# Altium schematic sheet PIC18F57Q84_Curiosity_Nano_Target_MCU.SchDoc
size A3; SheetTitle: Target MCU; CompanyName: Microchip Technology Inc.; Organization: Microchip Technology; Address1: 2355 West Chandler Blvd.; Address2: Chandler, AZ  85224; Address4: USA; SheetNumber: 2; SheetTotal: 4; Time: Time
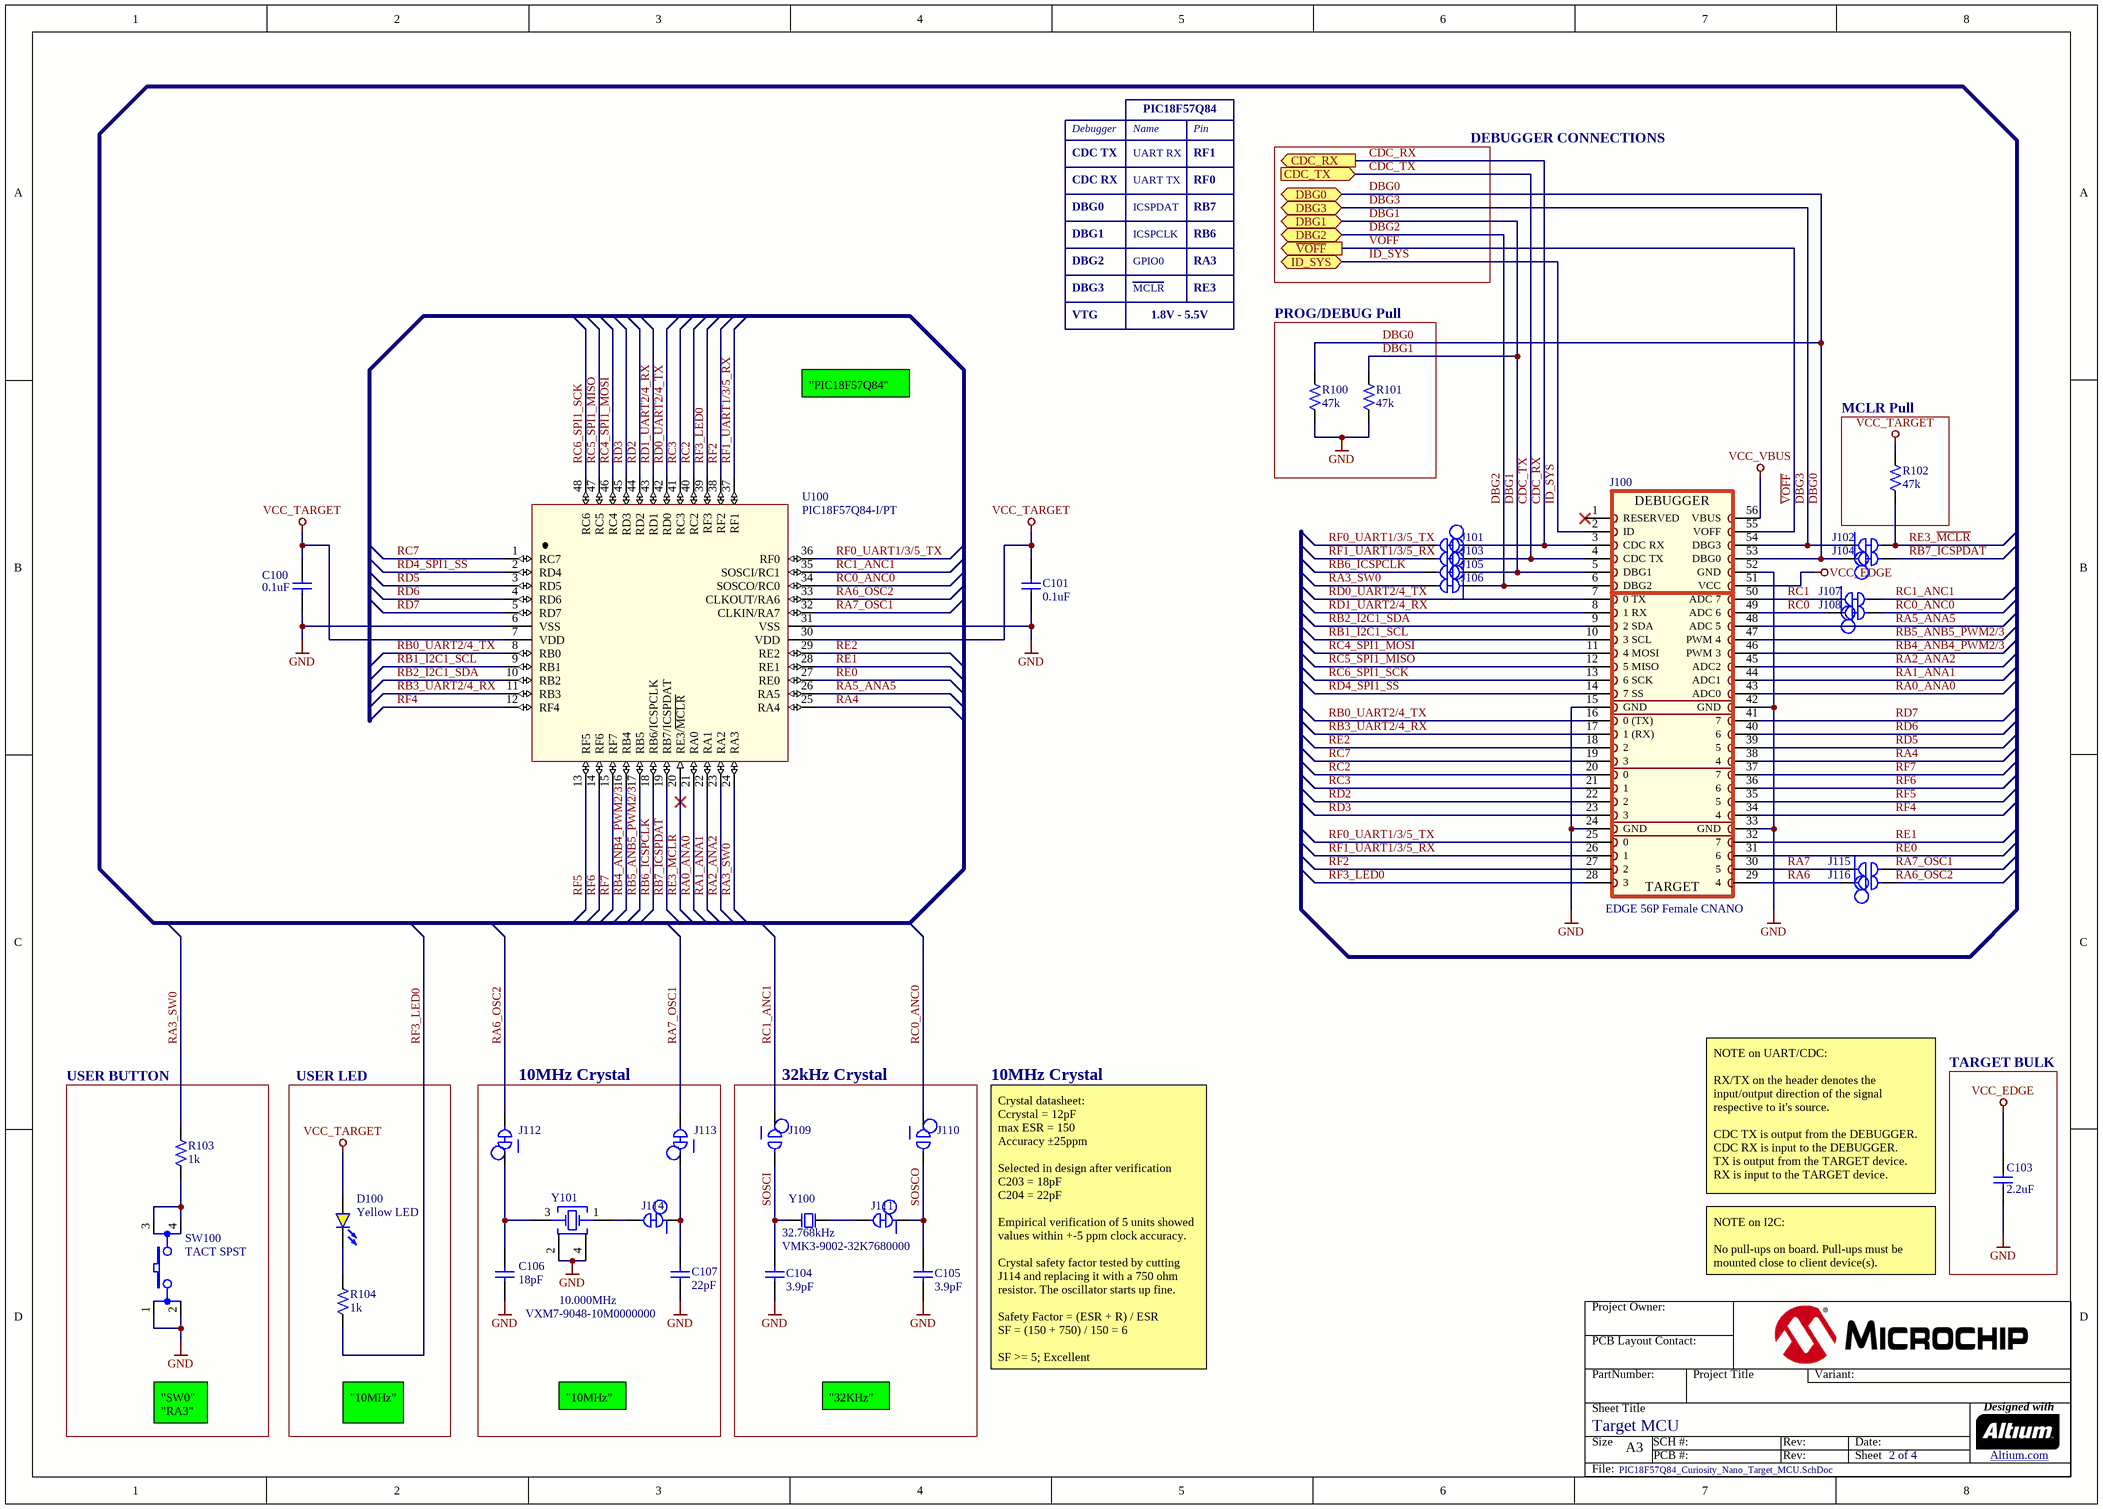
[diagram p0: PIC18F57Q84_Curiosity_Nano_Target_MCU.SchDoc]

## Parts
C100  value 0.1uF  [CAP_C_0402]  (hidden comment: Capacitor NP)
C101  value 0.1uF  [CAP_C_0402]  (hidden comment: Capacitor NP)
C103  value 2.2uF  [CAP_C_0402]  (hidden comment: Capacitor NP)
C104  value 3.9pF  [CAP_C_0402]  (hidden comment: Capacitor NP)
C105  value 3.9pF  [CAP_C_0402]  (hidden comment: Capacitor NP)
C106  value 18pF  [CAP_C_0402]  (hidden comment: Capacitor NP)
C107  value 22pF  [CAP_C_0402]  (hidden comment: Capacitor NP)
D100  value Yellow LED  [LED_0603_Yellow]  (hidden comment: LED_yellow)
J100  value EDGE 56P Female CNANO  [CON_EDGE_CNANO-56]  (hidden comment: CON EDGE CNANO-56)  (no BOM)
J101  CON JMPR LINK CLOSED  [CON_JMPR_0402_PCB_TRACE_LINK_0.9mm_PAD_0.6mm_PTH]  (value not drawn)  (net tie, no BOM)
J102  CON JMPR LINK CLOSED  [CON_JMPR_0402_PCB_TRACE_LINK_0.9mm_PAD_0.6mm_PTH]  (value not drawn)  (net tie, no BOM)
J103  CON JMPR LINK CLOSED  [CON_JMPR_0402_PCB_TRACE_LINK_0.9mm_PAD_0.6mm_PTH]  (value not drawn)  (net tie, no BOM)
J104  CON JMPR LINK CLOSED  [CON_JMPR_0402_PCB_TRACE_LINK_0.9mm_PAD_0.6mm_PTH]  (value not drawn)  (net tie, no BOM)
J105  CON JMPR LINK CLOSED  [CON_JMPR_0402_PCB_TRACE_LINK_0.9mm_PAD_0.6mm_PTH]  (value not drawn)  (net tie, no BOM)
J106  CON JMPR LINK CLOSED  [CON_JMPR_0402_PCB_TRACE_LINK_0.9mm_PAD_0.6mm_PTH]  (value not drawn)  (net tie, no BOM)
J107  CON JMPR LINK CLOSED  [CON_JMPR_0402_PCB_TRACE_LINK_0.9mm_PAD_0.6mm_PTH]  (value not drawn)  (net tie, no BOM)
J108  CON JMPR LINK CLOSED  [CON_JMPR_0402_PCB_TRACE_LINK_0.9mm_PAD_0.6mm_PTH]  (value not drawn)  (net tie, no BOM)
J109  CON JMPR SOLDER-STRAP OPEN SMD  [CON_JMPR_1mmX1mm_ROUND_SOLDER-STRAP]  (value not drawn)  (no BOM)
J110  CON JMPR SOLDER-STRAP OPEN SMD  [CON_JMPR_1mmX1mm_ROUND_SOLDER-STRAP]  (value not drawn)  (no BOM)
J111  CON JMPR LINK CLOSED  [CON_JMPR_0402_PCB_TRACE_LINK]  (value not drawn)  (net tie, no BOM)
J112  CON JMPR LINK CLOSED  [CON_JMPR_0402_PCB_TRACE_LINK_0.9mm_PAD_0.6mm_PTH]  (value not drawn)  (net tie, no BOM)
J113  CON JMPR LINK CLOSED  [CON_JMPR_0402_PCB_TRACE_LINK_0.9mm_PAD_0.6mm_PTH]  (value not drawn)  (net tie, no BOM)
J114  CON JMPR LINK CLOSED  [CON_JMPR_0402_PCB_TRACE_LINK]  (value not drawn)  (net tie, no BOM)
J115  CON JMPR SOLDER-STRAP OPEN SMD  [CON_JMPR_1mmX1mm_ROUND_SOLDER-STRAP]  (value not drawn)  (no BOM)
J116  CON JMPR SOLDER-STRAP OPEN SMD  [CON_JMPR_1mmX1mm_ROUND_SOLDER-STRAP]  (value not drawn)  (no BOM)
R100  value 47k  [RES_C_0402]  (hidden comment: Resistor)
R101  value 47k  [RES_C_0402]  (hidden comment: Resistor)
R102  value 47k  [RES_C_0402]  (hidden comment: Resistor)
R103  value 1k  [RES_C_0402]  (hidden comment: Resistor)
R104  value 1k  [RES_C_0402]  (hidden comment: Resistor)
SW100  value TACT SPST  [SW_TACT_SMD_DW_TS604VM1-035CR-R]  (hidden comment: Switch 4 Pin)
U100  value PIC18F57Q84-I/PT  [TQFP-48_7x7]  (hidden comment: PIC18F5xQ84 TQFP-48)
Y100  value 32.768kHz  Manufacturer Part Number 1: VMK3-9002-32K7680000  [CRYSTAL_VMK3_L3.2W1.5H0.9]  (hidden comment: Crystal 2 Pins)
Y101  value 10.000MHz  Manufacturer Part Number 1: VXM7-9048-10M0000000  [CRYSTAL_L3.2W2.5H0.8]  (hidden comment: Crystal 4 pins 1-3)

## Blocks framed on the sheet
PROG/DEBUG Pull: R100 R101
MCLR Pull: R102
USER BUTTON: R103 SW100
USER LED: D100 R104
10MHz Crystal: C106 C107 J112-J114 Y101
32kHz Crystal: C104 C105 J109-J111 Y100
TARGET BULK: C103

## Ports
CDC_RX (out), CDC_TX (in), DBG0 (bidir), DBG1 (bidir), DBG2 (bidir), DBG3 (bidir), ID_SYS (bidir), ~{VOFF} (out)

## Nets
GND: C100.2 C101.1 C103.1 C104.1 C105.2 C106.1 C107.1 J100.15(GND) J100.24(GND) J100.33(GND) J100.42(GND) J100.52(GND) R100.2 R101.2 SW100.1 SW100.2 U100.6(VSS) U100.31(VSS) Y101.2 Y101.4
VCC_EDGE: C103.2 J100.51(VCC)
VCC_TARGET: C100.1 C101.2 D100.1(A) R102.2 U100.7(VDD) U100.30(VDD)
VCC_VBUS: J100.56(VBUS)
CDC_RX: J100.3(CDC_RX) J101.1 ; port CDC_RX
CDC_TX: J100.4(CDC_TX) J103.1 ; port CDC_TX
DBG0: J100.53(DBG0) J104.1 R100.1 ; port DBG0
DBG1: J100.5(DBG1) J105.1 R101.1 ; port DBG1
DBG2: J100.6(DBG2) J106.1 ; port DBG2
DBG3: J100.54(DBG3) J102.1 ; port DBG3
ID_SYS: J100.2(ID) ; port ID_SYS
RA0_ANA0: J100.43(ADC0) U100.21(RA0)
RA1_ANA1: J100.44(ADC1) U100.22(RA1)
RA2_ANA2: J100.45(ADC2) U100.23(RA2)
RA3_SW0: J106.2 R103.1 U100.24(RA3)
RA4: J100.38(4) U100.25(RA4)
RA5_ANA5: J100.48(ADC_5) U100.26(RA5)
RA6: J100.29(4) J116.1
RA6_OSC2: J112.2 J116.2 U100.33(CLKOUT/RA6)
RA7: J100.30(5) J115.1
RA7_OSC1: J113.2 J115.2 U100.32(CLKIN/RA7)
RB0_UART2/4_TX: J100.16(0_(TX)) U100.8(RB0)
RB1_I2C1_SCL: J100.10(3_SCL) U100.9(RB1)
RB2_I2C1_SDA: J100.9(2_SDA) U100.10(RB2)
RB3_UART2/4_RX: J100.17(1_(RX)) U100.11(RB3)
RB4_ANB4_PWM2/3: J100.46(PWM_3) U100.16(RB4)
RB5_ANB5_PWM2/3: J100.47(PWM_4) U100.17(RB5)
RB6_ICSPCLK: J105.2 U100.18(RB6/ICSPCLK)
RB7_ICSPDAT: J104.2 U100.19(RB7/ICSPDAT)
RC0: J100.49(ADC_6) J108.1
RC0_ANC0: J108.2 J110.1 U100.34(SOSCO/RC0)
RC1: J100.50(ADC_7) J107.1
RC1_ANC1: J107.2 J109.1 U100.35(SOSCI/RC1)
RC2: J100.20(0) U100.40(RC2)
RC3: J100.21(1) U100.41(RC3)
RC4_SPI1_MOSI: J100.11(4_MOSI) U100.46(RC4)
RC5_SPI1_MISO: J100.12(5_MISO) U100.47(RC5)
RC6_SPI1_SCK: J100.13(6_SCK) U100.48(RC6)
RC7: J100.19(3) U100.1(RC7)
RD0_UART2/4_TX: J100.7(0_TX) U100.42(RD0)
RD1_UART2/4_RX: J100.8(1_RX) U100.43(RD1)
RD2: J100.22(2) U100.44(RD2)
RD3: J100.23(3) U100.45(RD3)
RD4_SPI1_SS: J100.14(7_SS) U100.2(RD4)
RD5: J100.39(5) U100.3(RD5)
RD6: J100.40(6) U100.4(RD6)
RD7: J100.41(7) U100.5(RD7)
RE0: J100.31(6) U100.27(RE0)
RE1: J100.32(7) U100.28(RE1)
RE2: J100.18(2) U100.29(RE2)
RE3_~{MCLR}: J102.2 R102.1 U100.20(RE3/~{MCLR})
RF0_UART1/3/5_TX: J100.25(0) J101.2 U100.36(RF0)
RF1_UART1/3/5_RX: J100.26(1) J103.2 U100.37(RF1)
RF2: J100.27(2) U100.38(RF2)
RF3_LED0: J100.28(3) R104.1 U100.39(RF3)
RF4: J100.34(4) U100.12(RF4)
RF5: J100.35(5) U100.13(RF5)
RF6: J100.36(6) U100.14(RF6)
RF7: J100.37(7) U100.15(RF7)
SOSCI: C104.2 J109.2 Y100.1(Osc1)
SOSCO: C105.1 J110.2 J111.1
~{VOFF}: J100.55(VOFF) ; port ~{VOFF}
NetC106_2: C106.2 J112.1 Y101.3
NetC107_2: C107.2 J113.1 J114.1
NetD100_2: D100.2(K) R104.2
NetJ111_2: J111.2 Y100.2(Osc2)
NetJ114_2: J114.2 Y101.1
NetR103_2: R103.2 SW100.3 SW100.4

Not connected (* = marked no-connect by the designer): J100 1(RESERVED)*

## Notes on the sheet
- PIC18F57Q84
- Debugger
- CDC TX
- CDC RX
- UART RX
- UART TX
- Name
- RF0
- RF1
- Pin
- DEBUGGER CONNECTIONS
- DBG0
- DBG1
- ICSPDAT
- ICSPCLK
- RB6
- RB7
- DBG2
- DBG3
- VTG
- GPIO0
- MCLR
- 1.8V - 5.5V
- RA3
- RE3
- "PIC18F57Q84"
- 10MHz Crystal
- NOTE on UART/CDC:
  RX/TX on the header denotes the input/output direction of the signal respective to it's source.
  CDC TX is output from the DEBUGGER.
  CDC RX is input to the DEBUGGER.
  TX is output from the TARGET device.
  RX is input to the TARGET device.
- NOTE on I2C:
  No pull-ups on board. Pull-ups must be mounted close to client device(s).
- Crystal datasheet:
  Ccrystal = 12pF
  max ESR = 150
  Accuracy ±25ppm
  Selected in design after verification
  C203 = 18pF
  C204 = 22pF
  Empirical verification of 5 units showed values within +-5 ppm clock accuracy.
  Crystal safety factor tested by cutting J114 and replacing it with a 750 ohm resistor. The oscillator starts up fine.
  Safety Factor = (ESR + R) / ESR
  SF = (150 + 750) / 150 = 6
  SF >= 5; Excellent
- "SW0"
  "RA3"
- "10MHz"
- "32KHz"
- Project Owner:
- PCB Layout Contact:
- PartNumber:
- Project Title
- Variant:
- Sheet Title
- Size
- A3
- SCH #:
- PCB #:
- Rev:
- Date:
- Sheet
- Designed with
- Altium.com <http://go.altium.com/MicrochipLandingPage_Evaluation.html>
- File:
- (in symbol CON2113) DEBUGGER; TARGET

## Library data of the parts
C100 C101 = CAP1033: Manufacturer 1: KEMET; Manufacturer Part Number 1: C0402C104K4RAC7867; Voltage: 16V; Description_: CAP CER 0.1uF 16V 10% X7R SMD 0402; Tolerance: 10%; Type: Ceramic; Populated: Yes; Temperature Coefficient: X7R; Restricted Sourcing: No; Package: 0402; Revision: 11; Symbol: Capacitor NP; Operating Temperature: -55C to +125C; Category: Capacitor; Manufacturer 2: Samsung Electro-Mechanics; Manufacturer Part Number 2: CL05B104KO5NNNC; Supplier 1: Digi-Key; Supplier Part Number 1: 399-C0402C104K4RAC7867TR-ND; Supplier 2: Digi-Key; Supplier Part Number 2: 1276-1001-1-ND; Manufacturer 3: Würth Elektronik; Manufacturer Part Number 3: 885012205037; Manufacturer 4: Samsung Electro-Mechanics; Manufacturer Part Number 4: CL05B104KO5NNND; Manufacturer 5: Samsung Electro-Mechanics; Manufacturer Part Number 5: CL05B104KO5NNNO; Manufacturer 6: Yageo; Manufacturer Part Number 6: CC0402KRX7R7BB104; Supplier 3: Digi-Key; Supplier Part Number 3: 732-7532-1-ND; Supplier 4: Mouser; Supplier Part Number 4: 187-CL05B104KO5NNND; Supplier 5: Samsung Electro-Mechanics; Supplier Part Number 5: CL05B104KO5NNNO; Supplier 6: Yageo; Supplier Part Number 6: CC0402KRX7R7BB104
C103 = CAP1208: Manufacturer 1: Murata; Manufacturer Part Number 1: GRM155R61A225KE95D; Voltage: 10V; Description_: CAP CER 2.2uF 10V 10% X5R SMD 0402; Tolerance: 10%; Type: Ceramic; Populated: YES; Temperature Coefficient: X5R; Restricted Sourcing: No; Package: 0402; Revision: 4; Symbol: Capacitor NP; Operating Temperature: -55C to +85C; Category: Capacitor; Supplier 1: Murata; Supplier Part Number 1: GRM155R61A225KE95D; Manufacturer 2: Samsung Electro-Mechanics; Manufacturer Part Number 2: CL05A225KP5NSNC; Supplier 2: Samsung Electro-Mechanics; Supplier Part Number 2: CL05A225KP5NSNC
C104 C105 = CAP2410: Manufacturer 1: KYOCERA AVX; Manufacturer Part Number 1: 04025A3R9CAT2A; Voltage: 50V; Description_: CAP CER 3.9pF 50V 0.25pF C0G SMD 0402; Tolerance: 0.25pF; Type: Ceramic; Populated: YES; Temperature Coefficient: C0G; Restricted Sourcing: No; Package: 0402; Revision: 2; Symbol: Capacitor NP; Operating Temperature: -55C to +125C; Category: Capacitor; Manufacturer 2: Kemet; Manufacturer Part Number 2: C0402C399C5GACTU; Supplier 1: Digi-Key; Supplier Part Number 1: 478-1065-1-ND; Supplier 2: Digi-Key; Supplier Part Number 2: 399-7793-1-ND
C106 = CAP1091: Manufacturer 1: Murata; Manufacturer Part Number 1: GCM1555C1H180JA16D; Voltage: 50V; Description_: CAP CER 18pF 50V 5% C0G SMD 0402; Tolerance: 5%; Temperature Coefficient: C0G; Type: Ceramic; Populated: YES; Restricted Sourcing: No; Package: 0402; Revision: 5; Symbol: Capacitor NP; Operating Temperature: -55C to +125C; Category: Capacitor; Manufacturer 2: Murata; Manufacturer Part Number 2: GRM1555C1H180JA01D; Manufacturer 3: Samsung Electro-Mechanics; Manufacturer Part Number 3: CL05C180JB5NNNC; Manufacturer 4: Yageo; Manufacturer Part Number 4: CC0402JRNPO9BN180; Manufacturer 5: Murata; Manufacturer Part Number 5: GRM1555C1H180JZ01; Supplier 1: Digi-Key; Supplier Part Number 1: 490-12650-2-ND; Supplier 2: Digi-Key; Supplier Part Number 2: 490-5858-1-ND; Supplier 3: Samsung Electro-Mechanics; Supplier Part Number 3: CL05C180JB5NNNC; Supplier 4: Yageo; Supplier Part Number 4: CC0402JRNPO9BN180; Supplier 5: Murata; Supplier Part Number 5: GRM1555C1H180JZ01
C107 = CAP1042: Manufacturer 1: Murata; Manufacturer Part Number 1: GRM1555C1H220JA01D; Voltage: 50V; Description_: CAP CER 22pF 50V 5% NP0 SMD 0402; Tolerance: 5%; Temperature Coefficient: NP0; Type: Ceramic; Populated: Yes; Restricted Sourcing: No; Package: 0402; Revision: 4; Symbol: Capacitor NP; Operating Temperature: -55C to +125C; Category: Capacitor; Supplier 1: Digi-Key; Supplier Part Number 1: 490-5868-2-ND
D100 = DIODE1547: LED; Manufacturer 1: Rohm Semiconductor; Manufacturer Part Number 1: SML-D12Y1WT86; Description_: LED YELLOW DIFFUSED 1608 SMD; Type: LED Single; Forward Current: 20mA; Populated: YES; Restricted Sourcing: No; Revision: 1; Symbol: LED_yellow; Package: 0603; Category: Diode; Supplier 1: Digi-Key; Supplier Part Number 1: SML-D12Y1WT86CT-ND
J100 = CON2113: Description_: CON EDGE CURIOSITY-NANO 2.54 56P Female PCB TH; Populated: MECH; Restricted Sourcing: No; Revision: 1; Symbol: CON EDGE CNANO-56; Type: Edge Card; Category: Connector; Assembly Type: SMD
J101-J108 J112 J113 = CON2115: Value: CON JMPR LINK CLOSED_0.9mm TH PAD; Description_: CON JUMPER 0402 CLOSED PCB TRACE LINK MANUAL CUT WITH 0.9mm TH PADS; Populated: DNP; Restricted Sourcing: No; Revision: 1; Symbol: CON JMPR LINK CLOSED; Type: Test Point; Category: Connector; Assembly Type: Mechanical
J109 J110 J115 J116 = CON2117: Value: CON JMPR SODER-STRAP OPEN; Description_: CON JUMPER SOLDER-STRAP OPEN 1mm X 1mm ROUND SMD; Populated: DNP; Restricted Sourcing: No; Revision: 1; Symbol: CON JMPR SOLDER-STRAP OPEN SMD; Type: Test Point; Category: Connector; Assembly Type: SMD
J111 J114 = CON2116: Value: CON 0402 PCB TRACE LINK; Description_: CON JUMPER 0402 CLOSED PCB TRACE LINK MANUAL CUT; Populated: DNP; Restricted Sourcing: No; Revision: 1; Symbol: CON JMPR LINK CLOSED; Category: Connector; Assembly Type: Mechanical
R100-R102 = RES2662: Manufacturer 1: Yageo; Manufacturer Part Number 1: RC0402FR-0747KL; Tolerance: 1%; Description_: RES TKF 47k 1% 1/16W SMD 0402; Voltage: 50V; Populated: YES; Restricted Sourcing: No; Package: 0402; Revision: 3; Symbol: Resistor; Category: Resistor; Type: RES SMD; Composition: TKF; Supplier 1: Digi-Key; Supplier Part Number 1: 311-47.0KLRCT-ND
R103 R104 = RES1022: Manufacturer 1: Panasonic; Manufacturer Part Number 1: ERJ-2RKF1001X; Tolerance: 1%; Description_: RES TKF 1k 1% 1/10W SMD 0402; Voltage: 50V; Power: 1/10W; Populated: YES; Temperature Coefficient: 100ppm/C; Package: 0402; Revision: 3; Symbol: Resistor; Operating Temperature: -55C to +155C; Category: Resistor; Type: RES SMD; Composition: TKF; Supplier 1: Digi-Key; Supplier Part Number 1: P1.00KLTR-ND
SW100 = SWITCH1172: Switch; Manufacturer 1: Dailywell Electronics Co.,Ltd.; Manufacturer Part Number 1: TS604VM1-035CR-R; Description_: SWITCH TACT SPST 12 50mA TS604VM1-035CR-R SMD; Voltage: 12V; Current: 50mA; Populated: YES; Restricted Sourcing: No; Revision: 2; Symbol: Switch 4 Pin; Operating Temperature: -40C to +85C; Category: Switch; Supplier 1: Cabcon A/S; Supplier Part Number 1: TS604VM1-035CR-R; Type: Tactile
U100 = MIC8901: Manufacturer 1: Microchip Technology; Manufacturer Part Number 1: PIC18F57Q84T-I/PT; Description_: MCHP MCU 8-BIT 64MHz 128kB 8kB PIC18F57Q84-I/PT TQFP-48; Populated: YES; Restricted Sourcing: No; Symbol: PIC18F5xQ84 TQFP-48; Type: 8-Bit; Revision: 2; Category: MCHP-Microcontroller; Manufacturer 2: Microchip Technology; Manufacturer Part Number 2: PIC18F57Q84-I/PT; Supplier 1: Microchip Technology; Supplier Part Number 1: PIC18F57Q84T-I/PT; Supplier 2: Microchip Technology; Supplier Part Number 2: PIC18F57Q84-I/PT; Operating Temperature: -40C to +85C
Y100 = MIC9479: Crystal; Manufacturer 1: Microchip Technology; Description_: MCHP CRYSTAL 32.768kHz 7pF VMK3-9002-32K7680000 SMD L3.2W1.5H0.9; Populated: YES; Restricted Sourcing: No; Revision: 2; Symbol: Crystal 2 Pins; Category: MCHP-Clock/Timing; Type: Crystal; Supplier 1: Microchip Technology; Supplier Part Number 1: VMK3-9002-32K7680000; Manufacturer 2: Microchip Technology; Manufacturer Part Number 2: VMK3-9002-32K7680000TR; Supplier 2: Microchip Technology; Supplier Part Number 2: VMK3-9002-32K7680000TR; Operating Temperature: -40C to +85C
Y101 = IC2551: Crystal; Manufacturer 1: Microchip Technology; Description_: MCHP CRYSTAL 10.000MHz 12pF VXM7-9048-10M0000000 SMD L3.2W2.5H0.8; Populated: YES; Restricted Sourcing: No; Revision: 1; Symbol: Crystal 4 pins 1-3; Category: MCHP-Clock/Timing; Type: Crystal; Manufacturer 2: Microchip Technology; Manufacturer Part Number 2: VXM7-9048-10M0000000TR; Supplier 1: Microchip Technology; Supplier Part Number 1: VXM7-9048-10M0000000; Supplier 2: Microchip Technology; Supplier Part Number 2: VXM7-9048-10M0000000TR; Operating Temperature: -40C to +85C